# EAGLE schematic astronaut_interface (EAGLE 7.5.0)
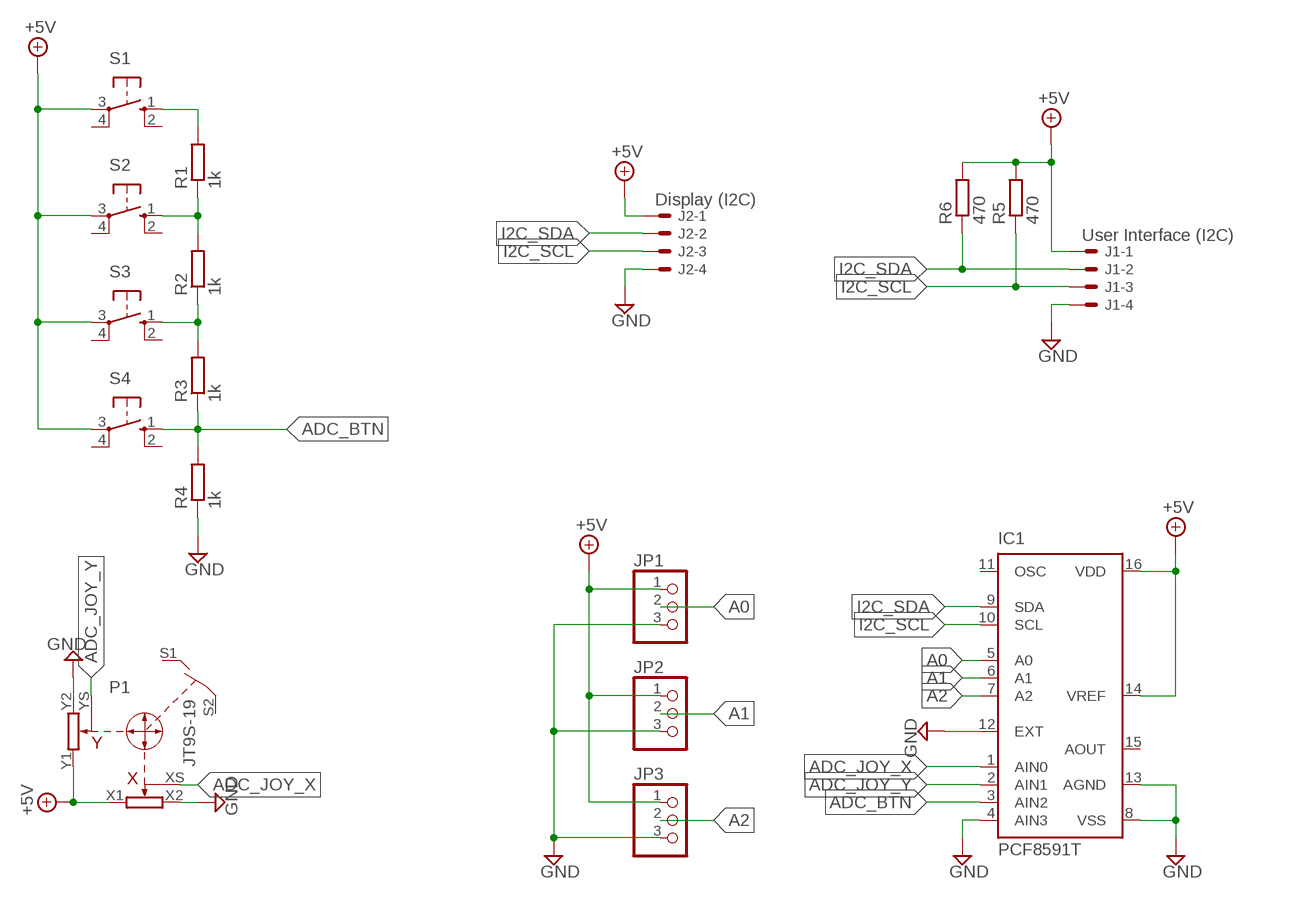
[diagram p0: schematic, sheet 1]

## Parts
IC1  PCF8591T  [SO16W]
J1  User Interface (I2C)  22-05-7048-04  [7395-04]
J2  Display (I2C)  22-05-7048-04  [7395-04]
JP1  PINHD-1X3  [1X03]
JP2  PINHD-1X3  [1X03]
JP3  PINHD-1X3  [1X03]
P1  JT9S-19  [JT9S-1P]
R1  1k  R-EU_R0805  [R0805]
R2  1k  R-EU_R0805  [R0805]
R3  1k  R-EU_R0805  [R0805]
R4  1k  R-EU_R0805  [R0805]
R5  470  R-EU_M0805  [M0805]
R6  470  R-EU_M0805  [M0805]
S1  10-XX  [B3F-10XX]
S2  10-XX  [B3F-10XX]
S3  10-XX  [B3F-10XX]
S4  10-XX  [B3F-10XX]

## Nets
+5V: IC1.14(VREF) IC1.16(VDD) J1.1 J2.1 JP1.1 JP2.1 JP3.1 P1.X1 P1.Y1 R5.2 R6.2 S1.3(P) S2.3(P) S3.3(P) S4.3(P)
A0: IC1.5(A0) JP1.2
A1: IC1.6(A1) JP2.2
A2: IC1.7(A2) JP3.2
ADC_BTN: IC1.3(AIN2) R3.1 R4.2 S4.1(S)
ADC_JOY_X: IC1.1(AIN0) P1.XS
ADC_JOY_Y: IC1.2(AIN1) P1.YS
GND: IC1.4(AIN3) IC1.8(VSS) IC1.12(EXT) IC1.13(AGND) J1.4 J2.4 JP1.3 JP2.3 JP3.3 P1.X2 P1.Y2 R4.1
I2C_SCL: IC1.10(SCL) J1.3 J2.3 R5.1
I2C_SDA: IC1.9(SDA) J1.2 J2.2 R6.1
N$4: R1.2 S1.1(S)
N$6: R2.1 R3.2 S3.1(S)
N$7: R1.1 R2.2 S2.1(S)
Unconnected: IC1.11(OSC) IC1.15(AOUT) P1.S1 P1.S2 S1.2(S1) S1.4(P1) S2.2(S1) S2.4(P1) S3.2(S1) S3.4(P1) S4.2(S1) S4.4(P1)

## Library data of the parts
IC1 = micro-philips:PCF8591: I2C-Bus D/A CONVERTER; MPN: PCF8591T/2,512; OC_FARNELL: 1826767; OC_NEWARK: 70R6911
J1 J2 = EP_molex_6410_7395:22-?-04: CONNECTOR wire to board 2.54 mm (.1 inch) pitch header
JP1-JP3 = pinhead:PINHD-1X3: PIN HEADER
P1 = jt9s-1p:JT9S-19: Joystick Potentiometer 10k
R1-R4 = rcl:R-EU_: RESISTOR, European symbol
R5 R6 = resistor:R-EU_: RESISTOR, European symbol
S1-S4 = switch-omron:10-XX: OMRON SWITCH; MPN: B3F-1000; OC_FARNELL: 176432; OC_NEWARK: 36M3542